# EAGLE design leaf_gen2_adapter (EAGLE 9.5.0)
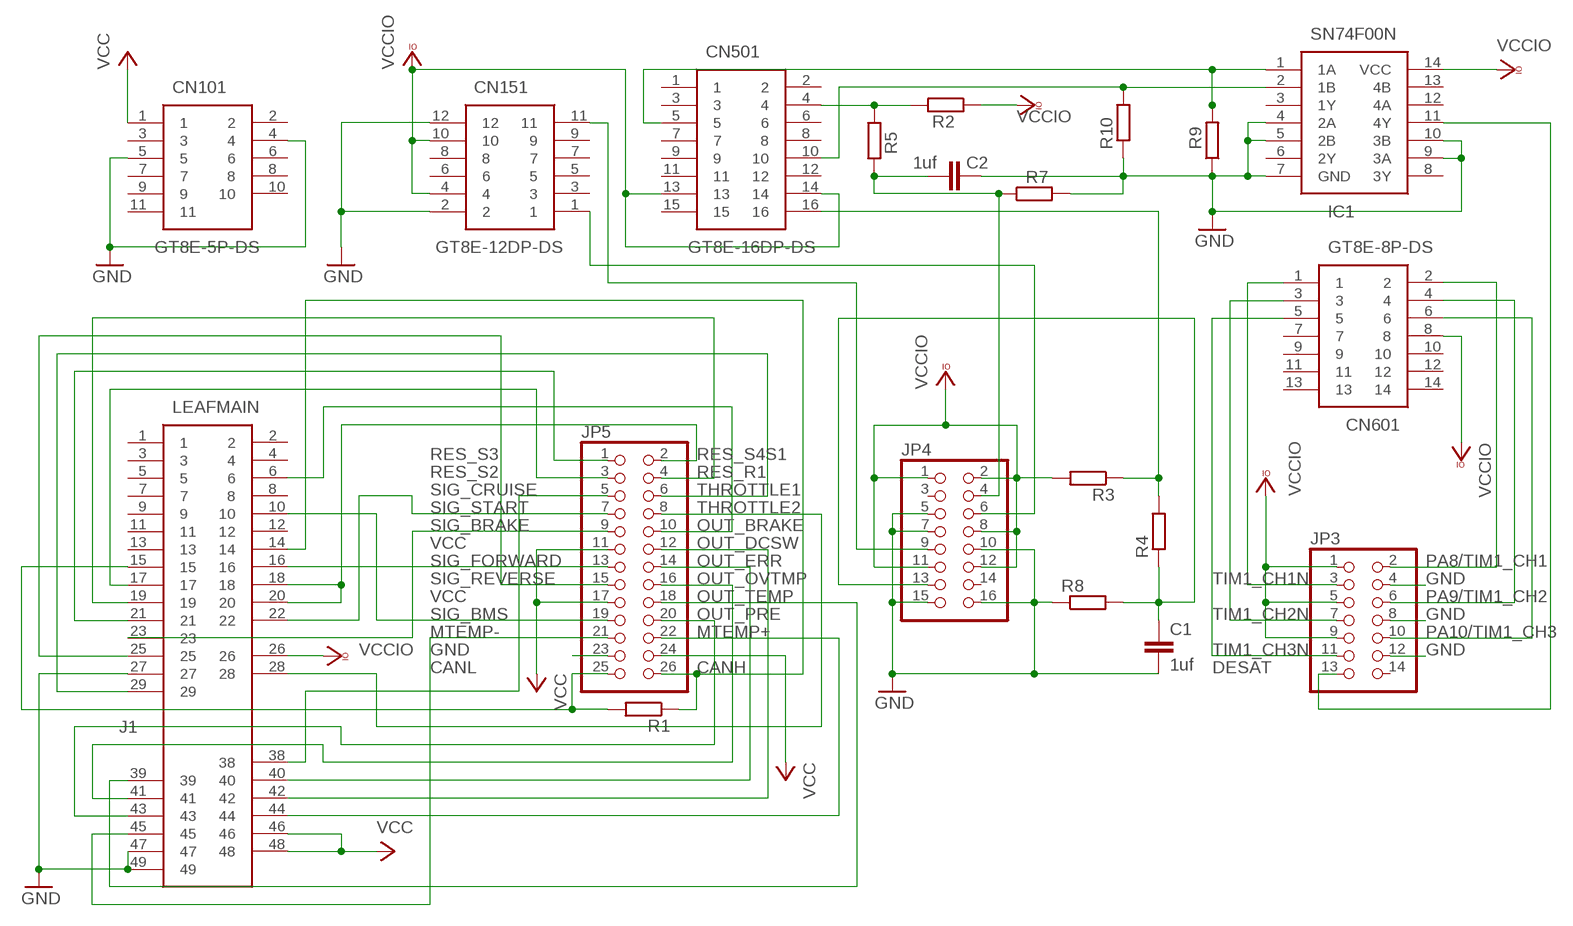
[diagram p0: schematic, sheet 1]

## Parts
C1  1uf  C-EU025-024X044  [C025-024X044]
C2  1uf  C-EU025-024X044  [C025-024X044]
CN101  GT8E-5P-DS  [GT8E5PDS]
CN151  GT8E-12DP-DS  [GT8E-12DP-DS]
CN501  GT8E-16DP-DS  [GT8E-16DP-DS]
CN601  GT8E-8P-DS  [GT8E8PDS]
IC1  SN74F00N  [DIP254P762X508-14]
J1  LEAFMAIN  [LEAFMAIN]
JP3  PINHD-2X7  [2X07]
JP4  PINHD-2X8  [2X08]
JP5  PINHD-2X13  [2X13]
R1  R-EU_0207/12  [0207/12]
R2  R-EU_0207/12  [0207/12]
R3  R-EU_0207/12  [0207/12]
R4  R-EU_0207/12  [0207/12]
R5  R-EU_0207/12  [0207/12]
R7  R-EU_0207/12  [0207/12]
R8  R-EU_0207/12  [0207/12]
R9  R-EU_0207/12  [0207/12]
R10  R-EU_0207/12  [0207/12]

## Nets
CANH: J1.14 JP5.26 R1.1
CANL: J1.15 JP5.25 R1.2
DESAT: IC1.11(4Y) JP3.13
GND: C1.2 C2.1 CN101.4 CN101.5 CN151.2 CN151.12 IC1.4(2A) IC1.5(2B) IC1.7(GND) IC1.9(3A) IC1.10(3B) J1.27 J1.47 J1.49 JP3.4 JP3.8 JP3.12 JP4.5 JP4.7 JP4.10 JP4.15 JP4.16 JP5.23 R7.2 R8.1 R9.1 R10.1
MTEMP+: J1.44 JP5.22
MTEMP-: J1.45 JP5.21
N$1: C1.1 JP4.13 R4.1 R8.2
N$2: CN501.16 R3.1 R4.2
N$3: CN151.1 JP4.6
N$4: CN501.4 R2.2 R5.1
N$5: C2.2 JP4.4 R5.2 R7.1
N$6: CN501.5 IC1.1(1A) R9.2
N$7: CN501.10 IC1.2(1B) R10.2
N$8: CN151.11 JP4.9
OUT_BRAKE: J1.6 JP5.10
OUT_DCSW: J1.42 JP5.12
OUT_ERR: J1.40 JP5.14
OUT_OVTMP: J1.41 JP5.16
OUT_PRE: J1.43 JP5.20
OUT_TEMP: J1.39 JP5.18
PA8/TIM1_CH1: CN601.2 JP3.2
PA9/TIM1_CH2: CN601.4 JP3.6
PA10/TIM1_CH3: CN601.6 JP3.10
RES_R1: J1.19 JP5.4
RES_S2: J1.17 JP5.3
RES_S3: J1.21 JP5.1
RES_S4S1: J1.18 J1.20 JP5.2
SIG_BMS: J1.10 JP5.19
SIG_BRAKE: J1.23 JP5.9
SIG_CRUISE: J1.38 JP5.5
SIG_FORWARD: J1.16 JP5.13
SIG_REVERSE: J1.25 JP5.15
SIG_START: J1.22 JP5.7
THROTTLE1: J1.29 JP5.6
THROTTLE2: J1.28 JP5.8
TIM1_CH1N: CN601.1 JP3.3
TIM1_CH2N: CN601.3 JP3.7
TIM1_CH3N: CN601.5 JP3.11
VCC: CN101.1 J1.46 J1.48 JP5.11 JP5.17 JP5.24
VCCIO: CN151.4 CN151.10 CN501.13 CN501.14 CN601.8 IC1.14(VCC) J1.26 JP3.1 JP3.5 JP3.9 JP4.1 JP4.2 JP4.8 JP4.11 JP4.12 R2.1 R3.2
Unconnected: CN101.2 CN101.3 CN101.6 CN101.7 CN101.8 CN101.9 CN101.10 CN101.11 CN151.3 CN151.5 CN151.6 CN151.7 CN151.8 CN151.9 CN501.1 CN501.2 CN501.3 CN501.6 CN501.7 CN501.8 CN501.9 CN501.11 CN501.12 CN501.15 CN601.7 CN601.9 CN601.10 CN601.11 CN601.12 CN601.13 CN601.14 IC1.3(1Y) IC1.6(2Y) IC1.8(3Y) IC1.12(4A) IC1.13(4B) J1.1 J1.2 J1.3 J1.4 J1.5 J1.7 J1.8 J1.9 J1.11 J1.12 J1.13 JP3.14 JP4.3 JP4.14

## Library data of the parts
C1 C2 = rcl:C-EU: CAPACITOR, European symbol; SPICEPREFIX: C
CN101 = SamacSys_Parts:GT8E-5P-DS
CN151 = SamacSys_Parts:GT8E-12DP-DS
CN501 = SamacSys_Parts:GT8E-16DP-DS
CN601 = SamacSys_Parts:GT8E-8P-DS
IC1 = SamacSys_Parts:SN74F00N
J1 = Leaf Main:LEAFMAIN
JP3 = pinhead:PINHD-2X7: PIN HEADER
JP4 = pinhead:PINHD-2X8: PIN HEADER
JP5 = pinhead:PINHD-2X13: PIN HEADER
R1-R5 R7-R10 = rcl:R-EU_: RESISTOR, European symbol; SPICEPREFIX: R

## Board
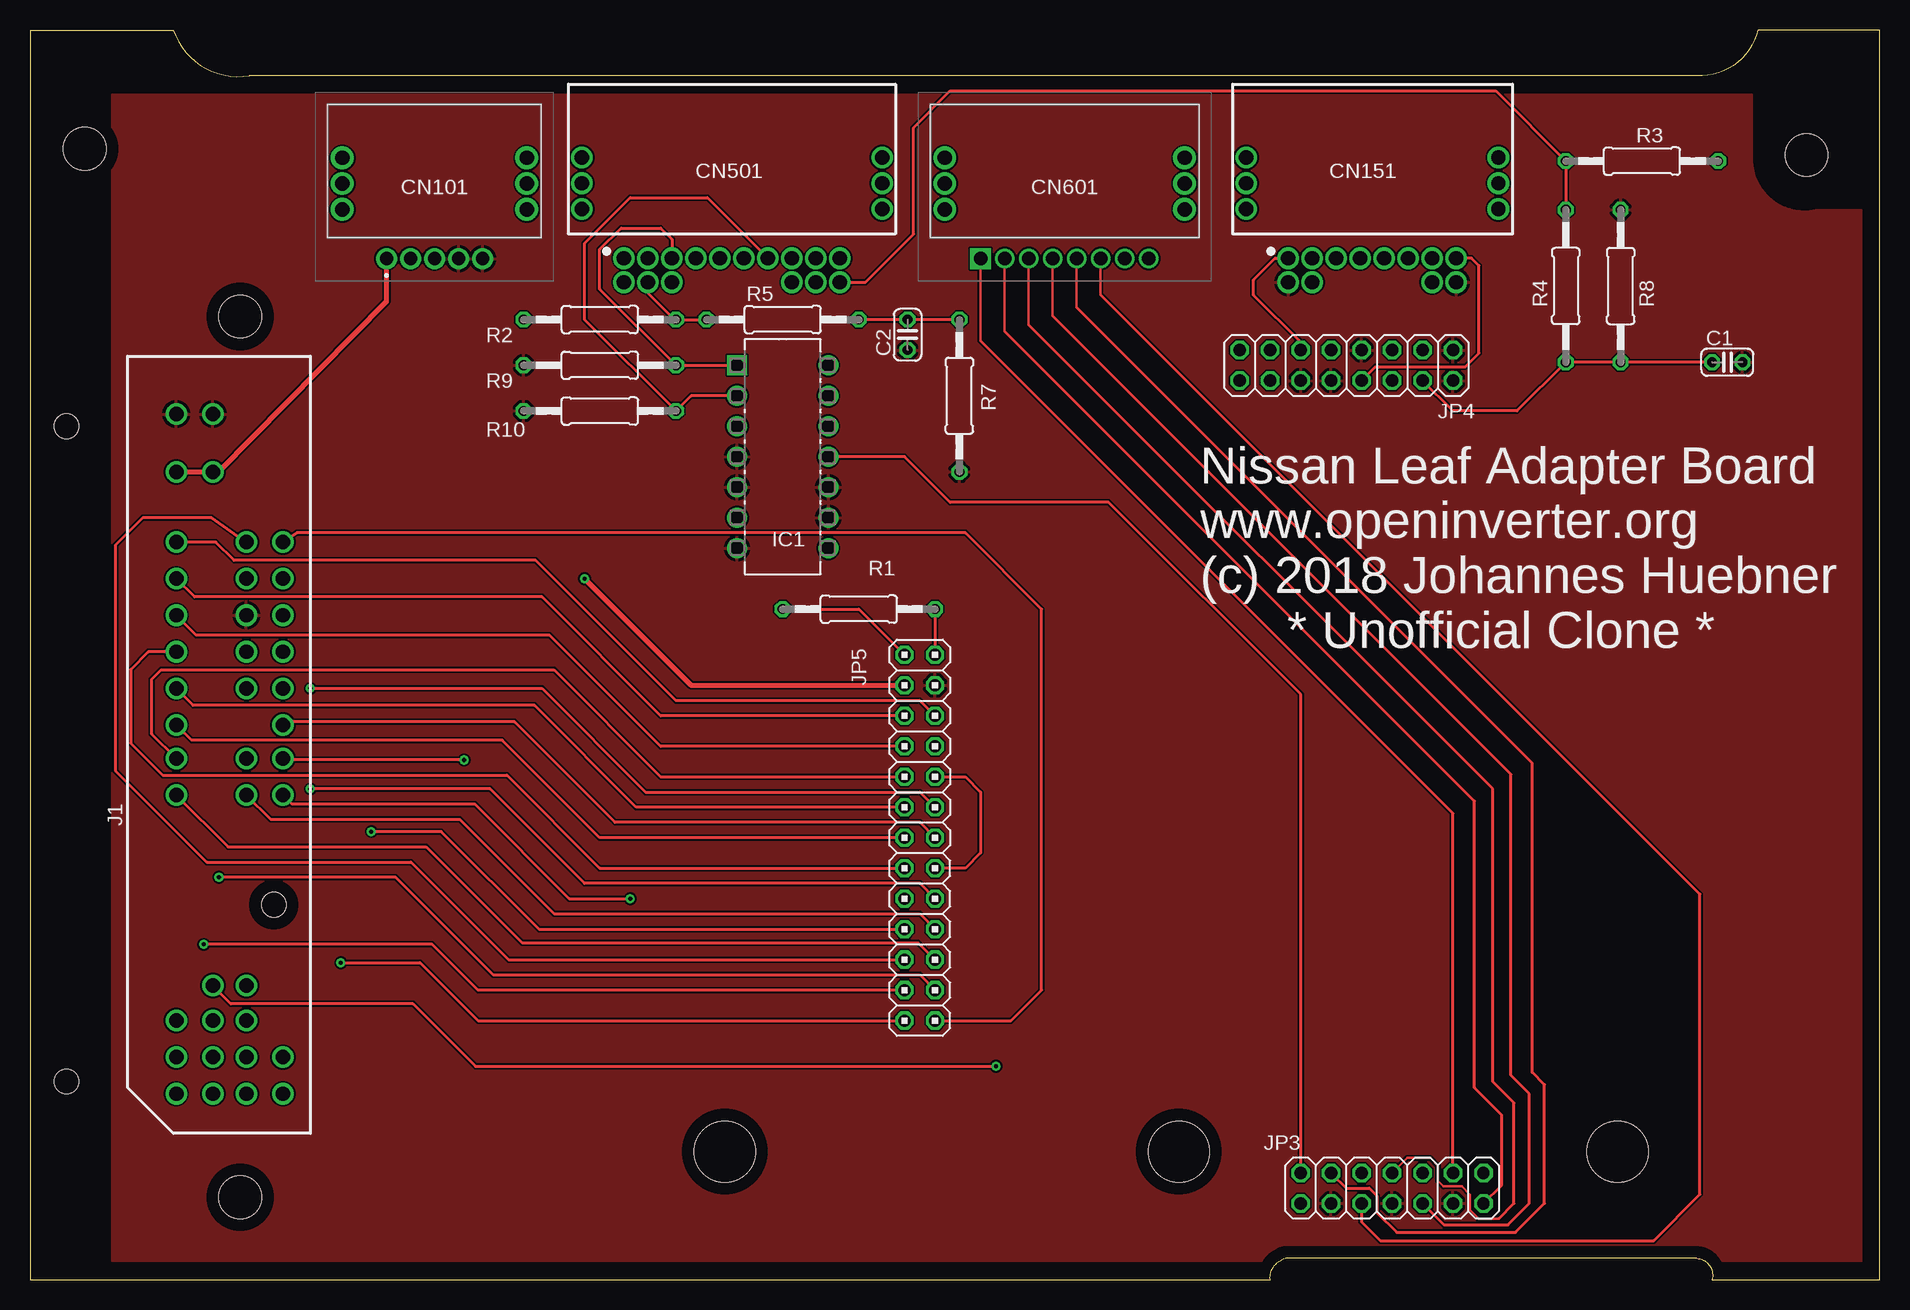
[diagram p1: board, top side]
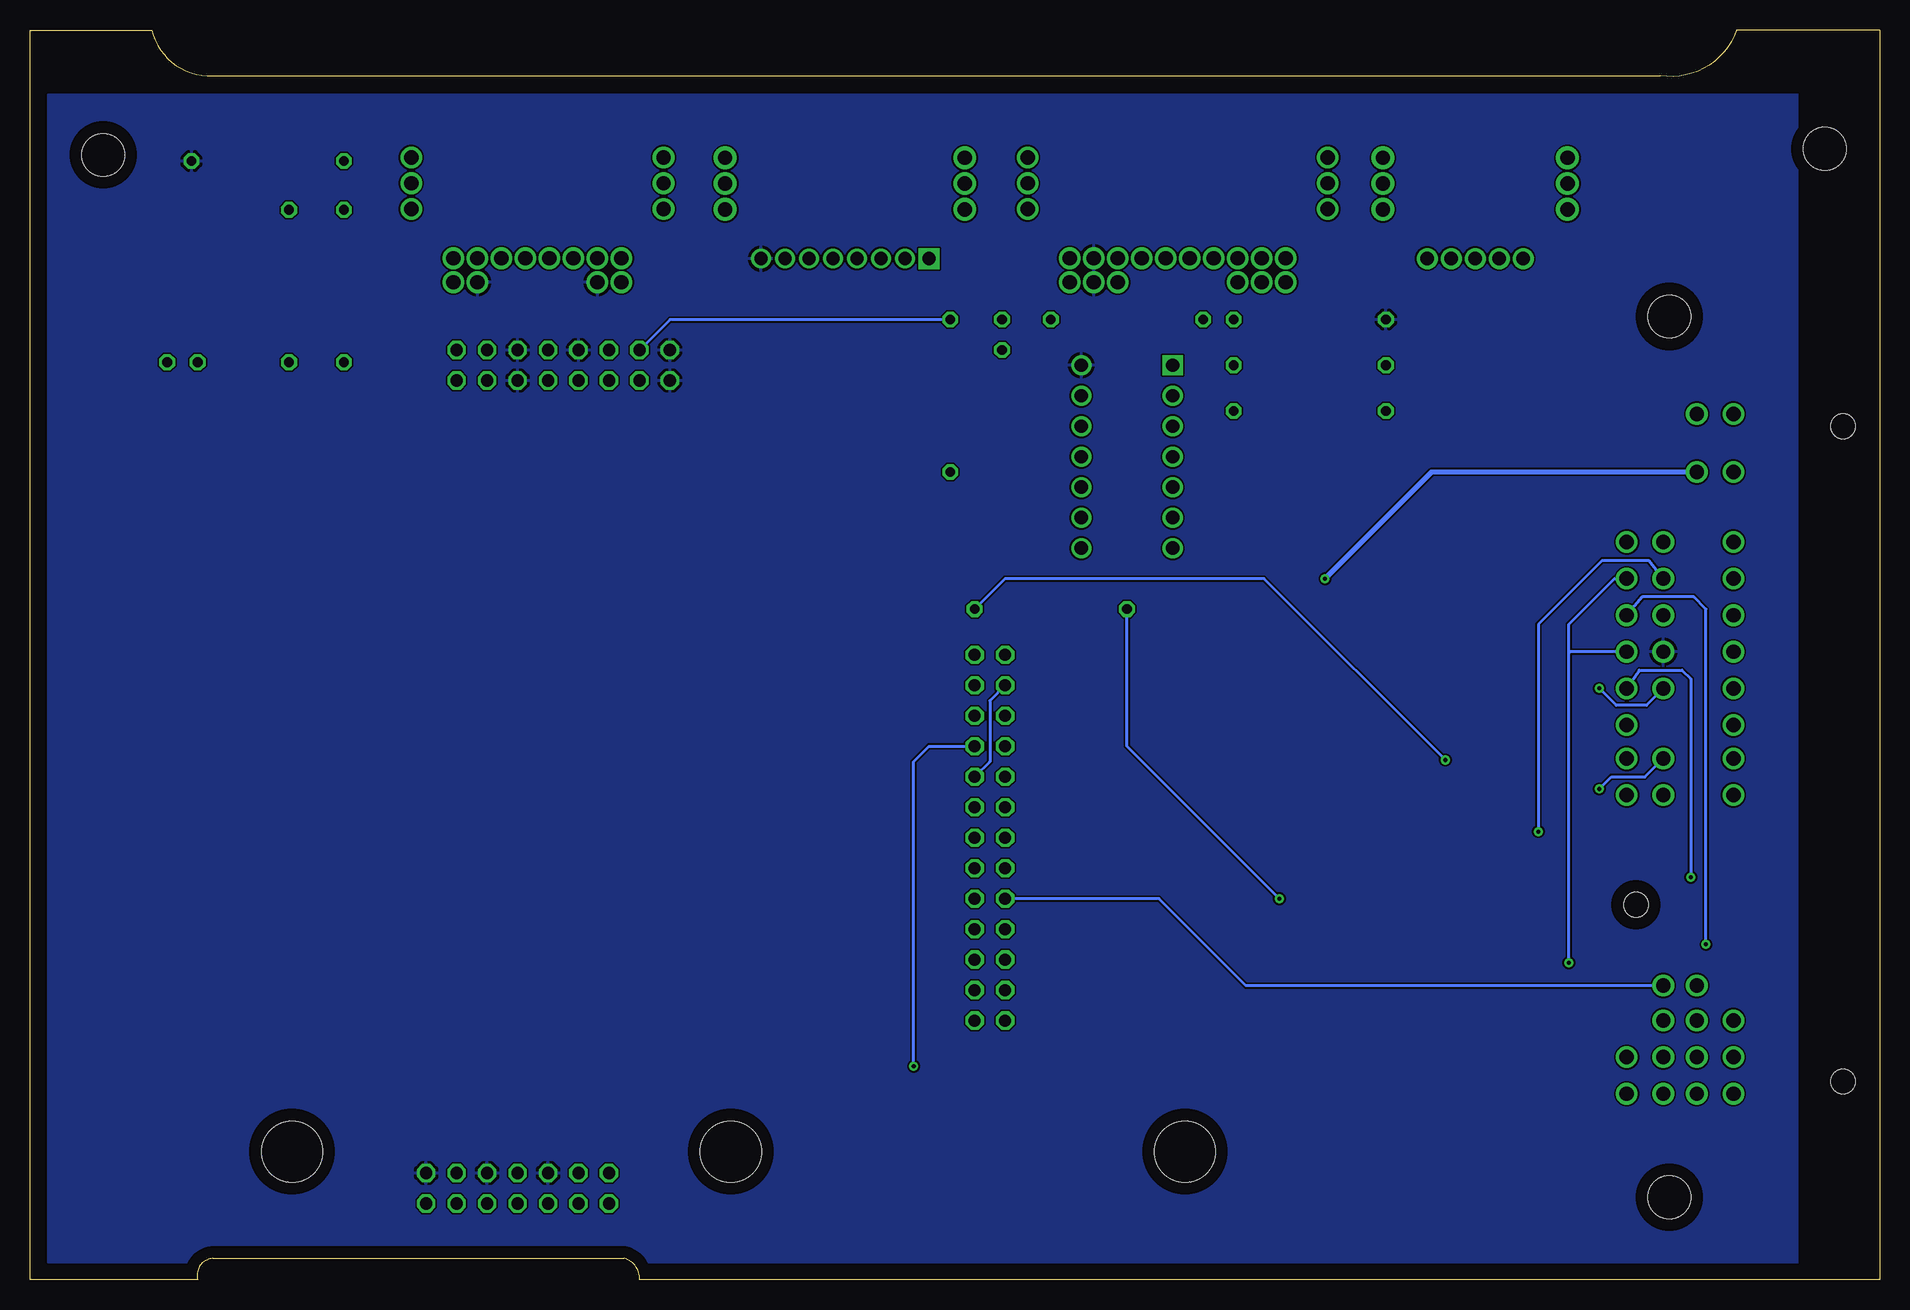
[diagram p2: board, bottom side, seen from below]

Size 154.18 x 104.14 mm. Coordinates in mm from the lower left corner, seen from the top.
Outline: 154.18,0 154.18,104.14 144.02,104.14 arc-80 138.94,100.33 18.29,100.33 arc-80 11.94,104.14 0,104.14 0,0 103.38,0 arc-80 104.65,1.78 138.94,1.78 arc-100 140.21,0 154.18,0
Copper layers (1*16): Top 0.035mm / dielectric 1.5mm / Bottom 0.035mm
Design rules "default": minimum track width 6mil, minimum drill 0.35mm, track to track 6mil, track to pad 6mil, pad to pad 6mil, via to via 6mil, smd to smd 6mil, copper to edge 40mil, drill to drill 6mil, minimum pad ring 10mil, minimum via ring 8mil, stop-mask expansion 4mil, vias tented up to drill 0mil, thermal gap 10mil
Holes 2.03 mm at 20.32,31.24 3.05,16.51 3.05,71.12
Holes 3.56 mm at 17.53,6.86 148.08,93.73 17.53,80.26 4.57,94.23
Holes 5.08 mm at 57.91,10.67 95.76,10.67 132.33,10.67

### Footprints (pad centres in the part's own frame; a part is rotated, then mirrored left to right if it is on the bottom)
C025-024X044 = drill 0.813 octagon: 1 -1.27,0; 2 1.27,0
GT8E5PDS = drill 1.1 pad 1.75: 1 0,0; 2 -2,0; 3 -4,0; 4 -6,0; 5 -8,0 | drill 1.2 pad 1.9: 6 3.69,-4.1; 7 3.69,-6.25; 8 3.69,-8.4; 9 -11.69,-4.1; 10 -11.69,-6.25; 11 -11.69,-8.4
GT8E-12DP-DS = drill 1.2 pad 1.8: 1 22.625,2; 2 22.625,4; 3 20.625,2; 4 20.625,4; 5 18.625,2; 6 16.625,2; 7 14.625,2; 8 12.625,2; 9 10.625,2; 10 10.625,4; 11 8.625,2; 12 8.625,4; 17 5.11,-2.1; 18 5.11,-4.25; 19 5.11,-6.4; 20 26.14,-6.4; 21 26.14,-4.25; 22 26.14,-2.1
GT8E-16DP-DS = drill 1.2 pad 1.8: 1 22.625,2; 2 22.625,4; 3 20.625,2; 4 20.625,4; 5 18.625,2; 6 18.625,4; 7 16.625,2; 8 14.625,2; 9 12.625,2; 10 10.625,2; 11 8.625,2; 12 8.625,4; 13 6.625,2; 14 6.625,4; 15 4.625,2; 16 4.625,4; 17 1.11,-2.1; 18 1.11,-4.25; 19 1.11,-6.4; 20 26.14,-6.4; 21 26.14,-4.25; 22 26.14,-2.1
GT8E8PDS = drill 1.1 pad 1.75 square: 1 0,0 | drill 1.1 pad 1.65: 2 -2,0; 3 -4,0; 4 -6,0; 5 -8,0; 6 -10,0; 7 -12,0; 8 -14,0 | drill 1.2 pad 1.9: 9 2.99,-4.1; 10 2.99,-6.25; 11 2.99,-8.4; 12 -16.99,-4.1; 13 -16.99,-6.25; 14 -16.99,-8.4
DIP254P762X508-14 = drill 1.118 pad 1.676 square: 1 -7.62,15.24 | drill 1.118 pad 1.676: 2 -7.62,12.7; 3 -7.62,10.16; 4 -7.62,7.62; 5 -7.62,5.08; 6 -7.62,2.54; 7 -7.62,0; 8 0,0; 9 0,2.54; 10 0,5.08; 11 0,7.62; 12 0,10.16; 13 0,12.7; 14 0,15.24
LEAFMAIN = drill 1.2 pad 1.8: 1 5.842,-11.684; 2 8.89,-11.684; 3 5.842,-8.636; 4 8.89,-8.636; 5 11.938,-8.636; 6 14.859,-8.636; 7 5.842,-5.842; 8 8.89,-5.842; 9 11.938,-5.842; 10 14.859,-5.842; 11 5.842,-2.794; 12 8.89,-2.794; 13 11.938,-2.794; 14 30.734,-11.684; 15 33.782,-11.684; 16 36.576,-11.684; 17 39.624,-11.684; 18 42.672,-11.684; 19 45.72,-11.684; 20 48.768,-11.684; 21 51.816,-11.684; 22 30.734,-8.636; 23 33.782,-8.636; 25 39.624,-8.636; 26 42.672,-8.636; 27 45.72,-8.636; 28 48.768,-8.636; 29 51.816,-8.636; 38 30.734,-2.794; 39 33.782,-2.794; 40 36.576,-2.794; 41 39.624,-2.794; 42 42.672,-2.794; 43 45.72,-2.794; 44 48.768,-2.794; 45 51.816,-2.794; 46 57.658,-2.794; 47 62.484,-2.794; 48 57.658,-5.842; 49 62.484,-5.842
2X07 = drill 1.016 octagon: 1 -7.62,-1.27; 2 -7.62,1.27; 3 -5.08,-1.27; 4 -5.08,1.27; 5 -2.54,-1.27; 6 -2.54,1.27; 7 0,-1.27; 8 0,1.27; 9 2.54,-1.27; 10 2.54,1.27; 11 5.08,-1.27; 12 5.08,1.27; 13 7.62,-1.27; 14 7.62,1.27
2X08 = drill 1.016 octagon: 1 -8.89,-1.27; 2 -8.89,1.27; 3 -6.35,-1.27; 4 -6.35,1.27; 5 -3.81,-1.27; 6 -3.81,1.27; 7 -1.27,-1.27; 8 -1.27,1.27; 9 1.27,-1.27; 10 1.27,1.27; 11 3.81,-1.27; 12 3.81,1.27; 13 6.35,-1.27; 14 6.35,1.27; 15 8.89,-1.27; 16 8.89,1.27
2X13 = drill 1.016 octagon: 1 -15.24,-1.27; 2 -15.24,1.27; 3 -12.7,-1.27; 4 -12.7,1.27; 5 -10.16,-1.27; 6 -10.16,1.27; 7 -7.62,-1.27; 8 -7.62,1.27; 9 -5.08,-1.27; 10 -5.08,1.27; 11 -2.54,-1.27; 12 -2.54,1.27; 13 0,-1.27; 14 0,1.27; 15 2.54,-1.27; 16 2.54,1.27; 17 5.08,-1.27; 18 5.08,1.27; 19 7.62,-1.27; 20 7.62,1.27; 21 10.16,-1.27; 22 10.16,1.27; 23 12.7,-1.27; 24 12.7,1.27; 25 15.24,-1.27; 26 15.24,1.27
0207/12 = drill 0.813 octagon: 1 -6.35,0; 2 6.35,0

### Placement (x,y rotation side)
C1  141.48,76.45 0 top
C2  73.15,78.74 90 top
CN101  29.72,85.09 180 top
CN151  127.51,87.12 180 top
CN501  72.14,87.12 180 top
CN601  79.25,85.09 180 top
IC1  66.55,60.96 0 top
J1  9.4,9.65 90 top
JP3  113.54,7.62 180 top
JP4  109.73,76.2 0 top
JP5  74.17,36.83 90 top
R1  69.09,55.88 0 top
R2  47.5,80.01 0 top
R3  134.37,93.22 0 top
R4  128.02,82.8 90 top
R5  62.74,80.01 0 top
R7  77.47,73.66 270 top
R8  132.59,82.8 270 top
R9  47.5,76.2 0 top
R10  47.5,72.39 0 top

### Tracks (layer width: path | path; a pad name or v marks a point on that pad's centre or on a via)
CANH  (via drill 0.35)
  Top 0.254: R1.1 69.09,55.88 JP5.26 | J1.14 21.84,39.62 37.08,39.62 44.96,31.75 v50.04,31.75
  Bottom 0.254: v50.04,31.75 62.74,44.45 R1.1
CANL  (via drill 0.35)
  Top 0.254: R1.2 JP5.25 | v36.2,43.31 21.21,43.31 J1.15
  Bottom 0.254: v36.2,43.31 51.31,58.42 72.9,58.42 R1.2
DESAT
  Top 0.254: JP3.13 105.92,48.77 89.92,64.77 76.71,64.77 72.9,68.58 IC1.11
GND
  pour Top: 152.65,1.52 6.86,1.52 6.86,98.81 143.51,98.81 143.51,93.24 arc100 148.82,89.15 152.65,89.15
MTEMP+
  Top 0.254: JP5.22 52.58,46.99 42.67,56.9 13.72,56.9 J1.44
MTEMP-
  Top 0.254: JP5.21 74.17,48.26 53.85,48.26 42.16,59.94 17.02,59.94 15.49,61.47 J1.45
N$1
  Top 0.254: C1.1 R8.2 R4.1 123.95,72.39 118.62,72.39 JP4.13
N$2
  Top 0.254: CN501.16 69.66,83.12 73.66,87.12 73.66,96.01 76.71,99.06 122.17,99.06 R3.1 R4.2
N$3
  Top 0.254: JP4.6 105.92,78.1 101.98,82.04 101.98,83.31 103.79,85.12 CN151.1
N$4
  Top 0.254: CN501.4 51.51,82.22 53.72,80.01 R2.2 R5.1
N$5
  Top 0.254: R5.2 C2.2 R7.1
  Bottom 0.254: R7.1 100.84,80.01 JP4.4
N$6
  Top 0.254: CN501.5 53.51,86.7 52.58,87.63 49.28,87.63 47.5,85.85 47.5,82.55 R9.2 IC1.1
N$7
  Top 0.254: IC1.2 55.12,73.66 R10.2 46.23,80.01 46.23,86.36 50.04,90.17 56.46,90.17 CN501.10
N$8
  Top 0.254: JP4.9 112.14,76.07 119.63,76.07 120.78,77.22 120.78,84.5 120.15,85.12 CN151.11
OUT_BRAKE
  Bottom 0.254: J1.6 52.83,24.51 60.07,31.75 JP5.10
OUT_DCSW
  Top 0.254: JP5.12 47.5,34.29 39.75,42.04 11.05,42.04 8.38,44.7 8.38,50.84 9.87,52.32 J1.42
OUT_ERR
  Top 0.254: J1.40 13.46,44.96 39.37,44.96 47.5,36.83 JP5.14
OUT_OVTMP
  Top 0.254: J1.41 13.6,47.86 42.05,47.86 50.54,39.37 JP5.16
OUT_PRE
  Top 0.254: JP5.20 52.58,44.45 43.31,53.72 13.84,53.72 J1.43
OUT_TEMP
  Top 0.254: J1.39 10.16,45.47 10.16,50.04 10.94,50.81 43.67,50.81 52.58,41.91 JP5.18
PA8/TIM1_CH1
  Top 0.203: 81.25,79.03 CN601.2
  Top 0.254: JP3.2 122.68,7.87 122.68,13.72 120.4,16 120.4,39.88 81.25,79.03
PA9/TIM1_CH2
  Top 0.203: 85.25,80.31 CN601.4
  Top 0.254: JP3.6 117.86,4.57 123.19,4.57 124.97,6.35 124.97,15.49 123.44,17.02 123.44,42.11 85.25,80.31
PA10/TIM1_CH3
  Top 0.203: 89.25,82.07 CN601.6
  Top 0.254: JP3.10 111,4.83 112.56,3.26 135.34,3.26 139.19,7.11 139.19,32.13 89.25,82.07
RES_R1  (via drill 0.35)
  Top 0.254: v14.48,27.94 33.53,27.94 37.34,24.13 JP5.4
  Bottom 0.254: v14.48,27.94 14.48,55.88 15.49,56.9 19.78,56.9 J1.19
RES_S2  (via drill 0.35)
  Top 0.254: JP5.3 74.17,25.4 38.61,25.4 30.48,33.53 v15.75,33.53
  Bottom 0.254: J1.17 20.04,50.8 16.48,50.8 15.75,50.07 v15.75,33.53
RES_S3
  Top 0.254: JP5.1 81.79,21.59 84.33,24.13 84.33,55.88 77.98,62.23 22.23,62.23 J1.21
RES_S4S1  (via drill 0.35)
  Top 0.254: v25.91,26.42 32.51,26.42 37.34,21.59 JP5.2
  Bottom 0.254: J1.20 22.1,58.42 25.91,54.61 25.91,52.34 | 25.91,52.34 25.82,52.32 J1.18 | v25.91,26.42 25.91,52.34
SIG_BMS  (via drill 0.35)
  Top 0.254: J1.10 15.48,24.26 16.75,22.99 31.92,22.99 37.12,17.78 v80.52,17.78
  Bottom 0.254: v80.52,17.78 80.52,43.18 79.25,44.45 JP5.19
SIG_BRAKE  (via drill 0.35)
  Top 0.254: JP5.9 74.17,33.02 46.23,33.02 38.35,40.89 v23.37,40.89
  Bottom 0.254: v23.37,40.89 22.35,41.91 19.56,41.91 J1.23
SIG_CRUISE
  Top 0.254: J1.38 16.51,36.07 33.02,36.07 41.02,28.07 74.04,28.07 JP5.5
SIG_FORWARD
  Top 0.254: JP5.13 74.17,38.1 48.77,38.1 40.39,46.48 21.34,46.48 J1.16
SIG_REVERSE  (via drill 0.35)
  Top 0.254: v23.37,49.28 42.67,49.28 51.31,40.64 74.17,40.64 JP5.15
  Bottom 0.254: J1.25 19.45,47.86 21.96,47.86 v23.37,49.28
SIG_START
  Top 0.254: J1.22 20.07,38.35 35.81,38.35 43.69,30.48 74.17,30.48 JP5.7
THROTTLE1
  Top 0.254: JP5.6 39.88,26.67 31.75,34.8 14.73,34.8 7.11,42.42 7.11,61.21 9.4,63.5 15.13,63.5 J1.29
THROTTLE2  (via drill 0.35)
  Top 0.254: v28.45,37.34 34.29,37.34 42.42,29.21 JP5.8
  Bottom 0.254: J1.28 19.25,59.94 23.11,59.94 28.45,54.61 v28.45,37.34
TIM1_CH1N
  Top 0.203: 79.25,78.23 CN601.1
  Top 0.254: JP3.3 118.62,38.86 79.25,78.23
TIM1_CH2N
  Top 0.203: JP3.7 114.81,10.16 116.72,10.16 117.37,9.5 117.37,8.23 117.83,7.77 119.36,7.77 120.04,7.09 120.04,5.81 120.77,5.08 122.43,5.08 | 83.25,79.57 CN601.3
  Top 0.254: 122.43,5.08 123.7,6.35 123.7,14.73 121.92,16.51 121.92,40.89 83.25,79.57
TIM1_CH3N
  Top 0.203: 87.25,81.03 CN601.5
  Top 0.254: JP3.11 109.73,7.62 111.64,7.62 112.27,6.99 112.27,5.59 113.92,3.94 123.83,3.94 126.24,6.35 126.24,16.26 125.22,17.27 125.22,43.05 87.25,81.03
VCC  (via drill 0.35)
  Top 0.254: JP5.17 77.98,41.91 79.25,40.64 79.25,35.56 77.98,34.29 JP5.11
  Top 0.406: J1.46 J1.48 15.75,67.31 29.72,81.53 CN101.1 | v46.23,58.42 55.12,49.53 JP5.24
  Bottom 0.254: JP5.24 74.17,48.26 74.17,43.18 JP5.17
  Bottom 0.406: J1.48 37.34,67.31 v46.23,58.42
VCCIO
  pour Bottom: 6.86,98.81 6.86,1.4 152.65,1.4 152.65,98.81

### Text on the board
tNames: ⏚ | Nissan Leaf Adapter Board / www.openinverter.org / (c) 2018 Johannes Huebner / * Unofficial Clone *